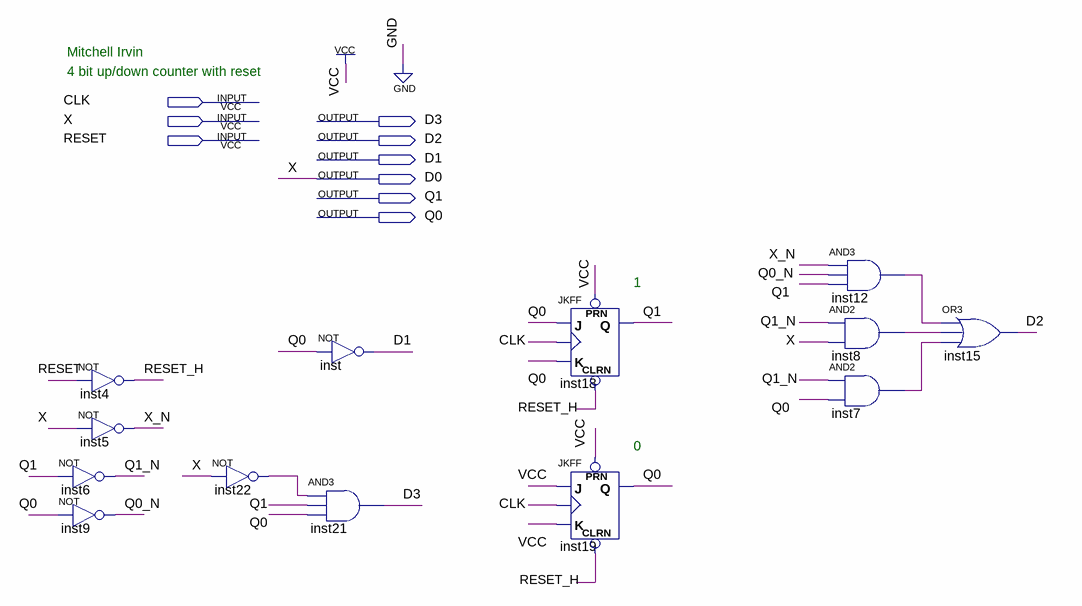
[diagram p0: schematic sheet]
// Quartus schematic Part1.bdf as structural Verilog: 13 symbols, 9 pins
module Part1 (
  input  CLK,
  input  X,
  input  RESET,
  output D3,
  output D2,
  output D1,
  output D0,
  output Q1,
  output Q0
);

  wire inst7_out, inst8_out, inst12_out, inst22_out, Q0_N, Q1_N, RESET_H, X_N;

  not inst4 (RESET_H, RESET);
  not inst5 (X_N, X);
  not inst6 (Q1_N, Q1);
  not inst9 (Q0_N, Q0);
  not inst22 (inst22_out, X);
  not inst (D1, Q0);
  and inst21 (D3, inst22_out, Q1, Q0);
  JKFF inst18 (.PRN(1'b1), .CLRN(RESET_H), .K(Q0), .J(Q0), .CLK(CLK), .Q(Q1));
  JKFF inst19 (.PRN(1'b1), .CLRN(RESET_H), .K(1'b1), .J(1'b1), .CLK(CLK), .Q(Q0));
  and inst12 (inst12_out, X_N, Q0_N, Q1);
  and inst8 (inst8_out, Q1_N, X);
  and inst7 (inst7_out, Q1_N, Q0);
  or inst15 (D2, inst12_out, inst8_out, inst7_out);

  assign D0 = X;

  // Notes on the sheet:
  //   Mitchell Irvin
  //   4 bit up/down counter with reset
  //   1
  //   0
endmodule
